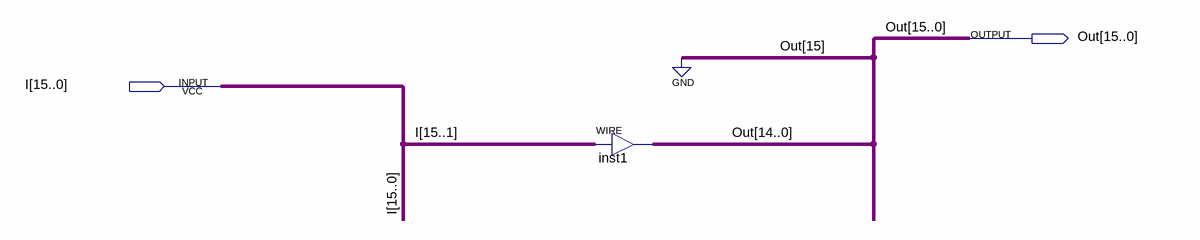
[diagram p0: schematic sheet]
// Quartus schematic SHR1.bdf as structural Verilog: 1 symbols, 2 pins
module SHR1 (
  input  [15:0] I,
  output [15:0] Out
);

  assign Out[14:0] = I[15:1];  // WIRE inst1

  assign Out[15] = 1'b0;
endmodule
